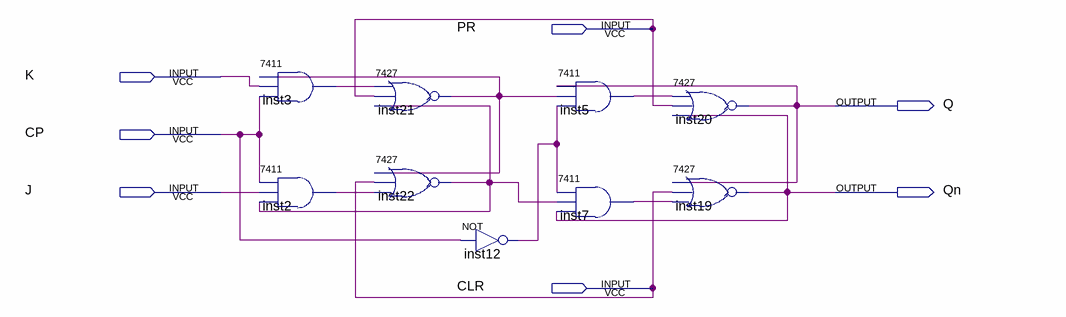
[diagram p0: schematic sheet]
// Quartus schematic P.bdf as structural Verilog: 9 symbols, 7 pins
module P (
  input  PR,
  input  K,
  input  CP,
  input  J,
  input  CLR,
  output Q,
  output Qn
);

  wire inst2_1, inst3_1, inst5_1, inst7_1, inst12_out, inst21_1, inst22_1;

  \7411  inst3 (.\2 (inst21_1), .\3 (K), .\4 (CP), .\1 (inst3_1));
  \7411  inst2 (.\2 (CP), .\3 (J), .\4 (inst22_1), .\1 (inst2_1));
  \7427  inst21 (.\4 (inst22_1), .\3 (PR), .\2 (inst3_1), .\1 (inst21_1));
  \7427  inst22 (.\4 (inst2_1), .\3 (CLR), .\2 (inst21_1), .\1 (inst22_1));
  not inst12 (inst12_out, CP);
  \7411  inst5 (.\2 (Q), .\3 (inst21_1), .\4 (inst12_out), .\1 (inst5_1));
  \7411  inst7 (.\2 (inst12_out), .\3 (inst22_1), .\4 (Qn), .\1 (inst7_1));
  \7427  inst20 (.\4 (Qn), .\3 (PR), .\2 (inst5_1), .\1 (Q));
  \7427  inst19 (.\4 (inst7_1), .\3 (CLR), .\2 (Q), .\1 (Qn));
endmodule
